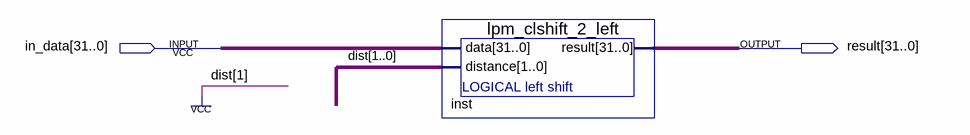
[diagram p0: schematic sheet]
// Quartus schematic shift2_left.bdf as structural Verilog: 1 symbols, 2 pins
module shift2_left (
  input  [31:0] in_data,
  output [31:0] result
);

  wire [0:0] \dist ;

  lpm_clshift_2_left inst (.data(in_data), .distance({1'b1, \dist [0]}), .result(result));
endmodule
